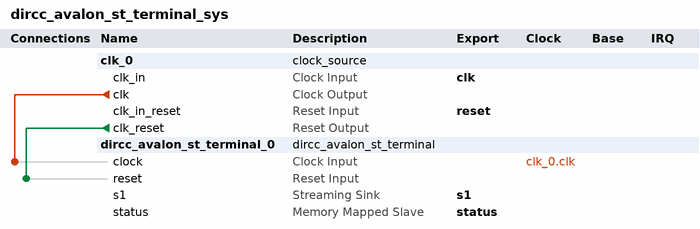
[diagram p0: system contents]
# Platform Designer (Qsys) system dircc_avalon_st_terminal_sys, Cyclone V 5CSEMA5F31C6
# Parameters at their usual value, and those the tool derives, are not listed.
package require -exact qsys 16.1
create_system dircc_avalon_st_terminal_sys
set_project_property DEVICE_FAMILY {Cyclone V}
set_project_property DEVICE 5CSEMA5F31C6

add_instance clk_0 clock_source 16.1
set_instance_parameter_value clk_0 clockFrequency 50000000

add_instance dircc_avalon_st_terminal_0 dircc_avalon_st_terminal 1.0
set_instance_parameter_value dircc_avalon_st_terminal_0 DATA_WIDTH 32

# connections
add_connection clk_0.clk dircc_avalon_st_terminal_0.clock clock
add_connection clk_0.clk_reset dircc_avalon_st_terminal_0.reset reset

# exported interfaces
add_interface clk clock sink
set_interface_property clk EXPORT_OF clk_0.clk_in
add_interface reset reset sink
set_interface_property reset EXPORT_OF clk_0.clk_in_reset
add_interface s1 avalon_streaming sink
set_interface_property s1 EXPORT_OF dircc_avalon_st_terminal_0.s1
add_interface status avalon slave
set_interface_property status EXPORT_OF dircc_avalon_st_terminal_0.status

set_interconnect_requirement {$system} qsys_mm.clockCrossingAdapter HANDSHAKE
set_interconnect_requirement {$system} qsys_mm.enableEccProtection FALSE
set_interconnect_requirement {$system} qsys_mm.insertDefaultSlave FALSE
set_interconnect_requirement {$system} qsys_mm.maxAdditionalLatency 1

save_system dircc_avalon_st_terminal_sys.qsys
